# Altium schematic sheet XL_N76E003K2._MAIN.SchDoc
size A4
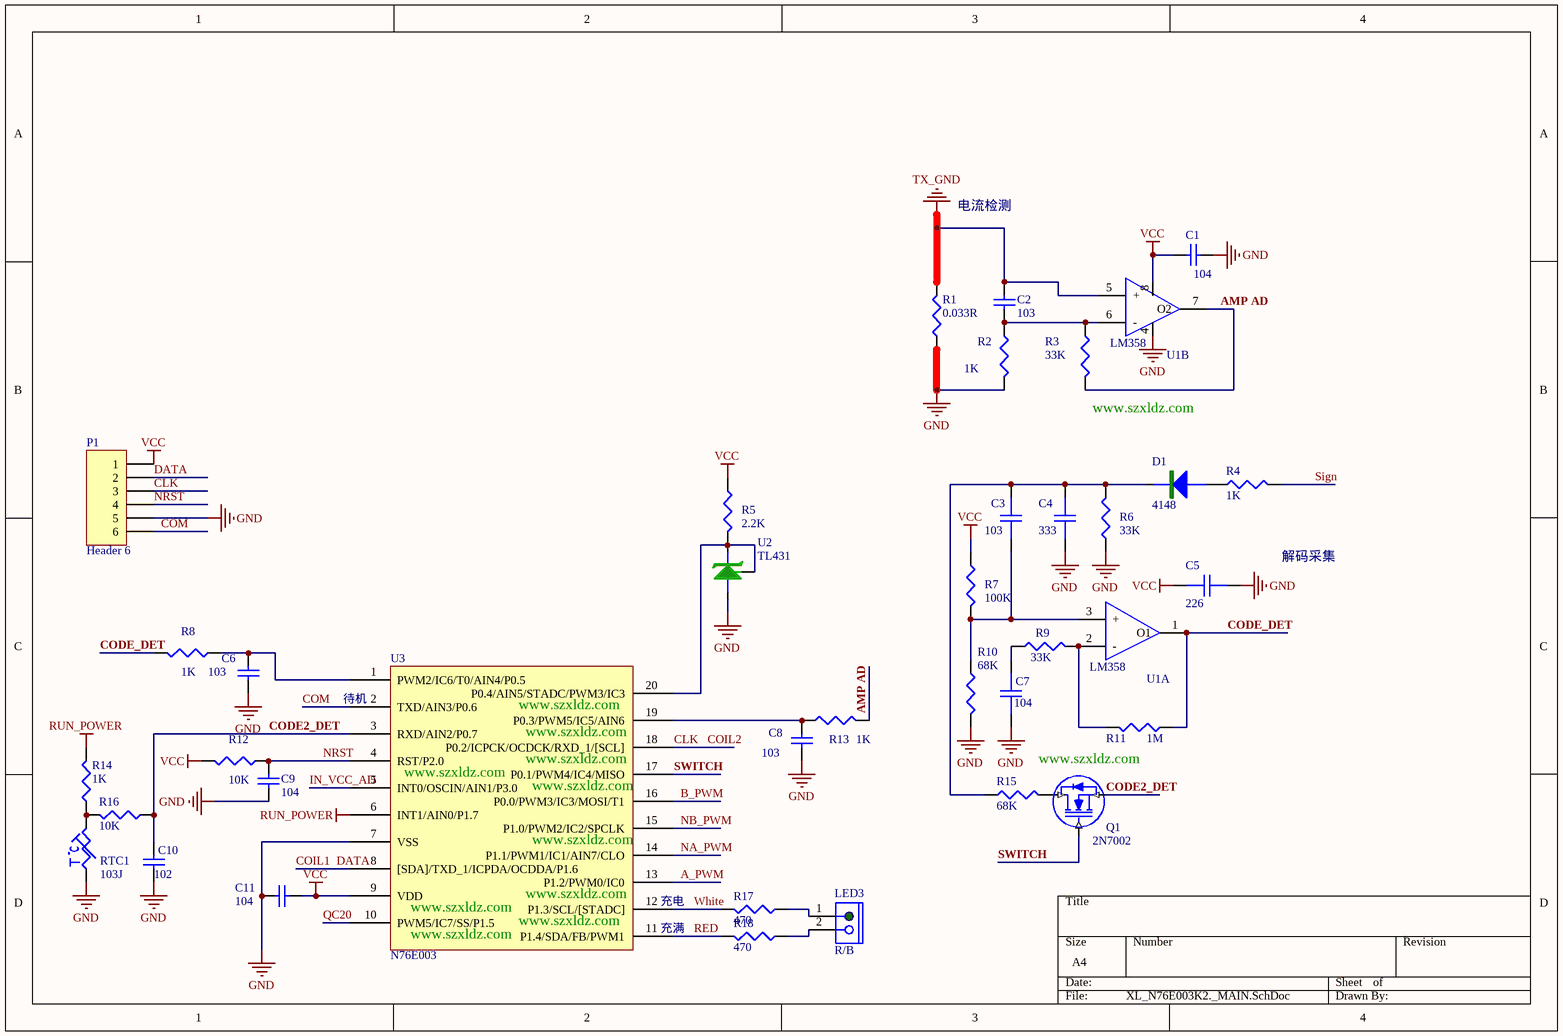
[diagram p0: XL_N76E003K2._MAIN.SchDoc]

## Parts
C1  104  [C0402]
C2  103  [C0402]
C3  103  [C0402]
C4  333  [C0402]
C5  226  [C0805]
C6  103  [C0402]
C7  104  [C0402]
C8  103  [C0402]
C9  104  [C0402]
C10  102  [C0402]
C11  104  [C0402]
D1  4148  [sod323]
LED3  R/B  [PIN2_2.54]
P1  Header 6  [SPIN6]
Q1  2N7002  [SOT-23B]
R1  0.033R  [R0805]
R2  1K  [R0402]
R3  33K  [R0402]
R4  1K  [R0402]
R5  2.2K  [R0402]
R6  33K  [R0402]
R7  100K  [R0402]
R8  1K  [R0402]
R9  33K  [R0402]
R10  68K  [R0402]
R11  1M  [R0402]
R12  10K  [R0402]
R13  1K  [R0402]
R14  1K  [R0402]
R15  68K  [R0402]
R16  10K  [R0402]
R17  470  [R0402]
R18  470  [R0402]
RTC1  103J  [R0402]
U1  LM358  [SOP8]  (parts A,B of 2)
U2  TL431  [SOT-23-431]
U3  N76E003  [SOP20]

## Nets
GND: C1.1 C4.1 C5.1 C6.1 C7.1 C8.2 C9.2 C10.1 C11.1 P1.5 R1.1 R2.2 R6.1 R10.2 RTC1.1 U1.4 U2.1 U3.7(VSS)
RUN_POWER: R14.2 U3.6(INT1/AIN0/P1.7)
TX_GND: C2.1 R1.2 U1.5(+)
VCC: C1.2 C5.2 C11.2 P1.1 R5.1 R7.1 R12.2 U1.8 U3.9(VDD)
A_PWM: U3.13(P1.2/PWM0/IC0)
AMP AD: R3.2 R13.2 U1.7(O2)
B_PWM: U3.16(P0.0/PWM3/IC3/MOSI/T1)
CLK: P1.3 U3.18(P0.2/ICPCK/OCDCK/RXD_1/[SCL])  [also labelled COIL2]
CODE2_DET: C10.2 Q1.E(S) R16.1 U3.3(RXD/AIN2/P0.7)
CODE_DET: R8.2 R11.1 U1.1(O1)
COIL1: P1.2 U3.8([SDA]/TXD_1/ICPDA/OCDDA/P1.6)  [also labelled DATA]
COM: P1.6 U3.2(TXD/AIN3/P0.6)
IN_VCC_AD: U3.5(INT0/OSCIN/AIN1/P3.0)
NA_PWM: U3.14(P1.1/PWM1/IC1/AIN7/CLO)
NB_PWM: U3.15(P1.0/PWM2/IC2/SPCLK)
NRST: C9.1 P1.4 R12.1 U3.4(RST/P2.0)
QC20: U3.10(PWM5/IC7/SS/P1.5)
RED: R18.1 U3.11(P1.4/SDA/FB/PWM1)
Sign: R4.2
SWITCH: Q1.B(G) U3.17(P0.1/PWM4/IC4/MISO)
White: R17.1 U3.12(P1.3/SCL/[STADC])
NetC2_2: C2.2 R2.1 R3.1 U1.6(-)
NetC3_1: C3.1 C4.2 D1.2 R6.2 R15.1
NetC3_2: C3.2 R7.2 R10.1 U1.3(+)
NetC6_2: C6.2 R8.1 U3.1(PWM2/IC6/T0/AIN4/P0.5)
NetC7_2: C7.2 R9.1
NetC8_1: C8.1 R13.1 U3.19(P0.3/PWM5/IC5/AIN6)
NetD1_1: D1.1 R4.1
NetLED3_1: LED3.1 R17.2
NetLED3_2: LED3.2 R18.2
NetQ1_C: Q1.C(D) R15.2
NetR5_2: R5.2 U2.2 U2.3 U3.20(P0.4/AIN5/STADC/PWM3/IC3)
NetR9_2: R9.2 R11.2 U1.2(-)
NetR14_1: R14.1 R16.2 RTC1.2

## Notes on the sheet
- 电流检测
- (near R3) www.szxldz.com
- 解码采集
- (near U3) 待机
- (near U3) www.szxldz.com
- www.szxldz.com
- (near U3) 充电
- (near U3) 充满

## Library data of the parts
C1 C6 C8-C11 = Cap: Capacitor; Published: 8-Jun-2000; LatestRevisionDate: 17-Jul-2002; LatestRevisionNote: Re-released for DXP Platform.; Publisher: Altium Limited
  C1 C9: Value: 104
  C6 C8: Value: 103
  C10: Value: 102
C2 = Cap: Capacitor; Value: 104; Published: 8-Jun-2000; LatestRevisionDate: 17-Jul-2002; LatestRevisionNote: Re-released for DXP Platform.; Publisher: Altium Limited
C3-C5 C7 = CH
D1 = D0: 1N4001
LED3 = CON2
P1 = Header 6: Header, 6-Pin; LatestRevisionDate: 17-Jul-2002; LatestRevisionNote: Re-released for DXP Platform.; Publisher: Altium Limited
Q1 = MOSFETN
R1 R3 R5-R7 R9-R11 R15-R18 = R: 1K
R2 R4 R8 R12-R14 = R
RTC1 = RTC
U1 = 4558
U2 = IC TL431: IC
U3 = 103F